# EAGLE design M720db (EAGLE 6.6.0)
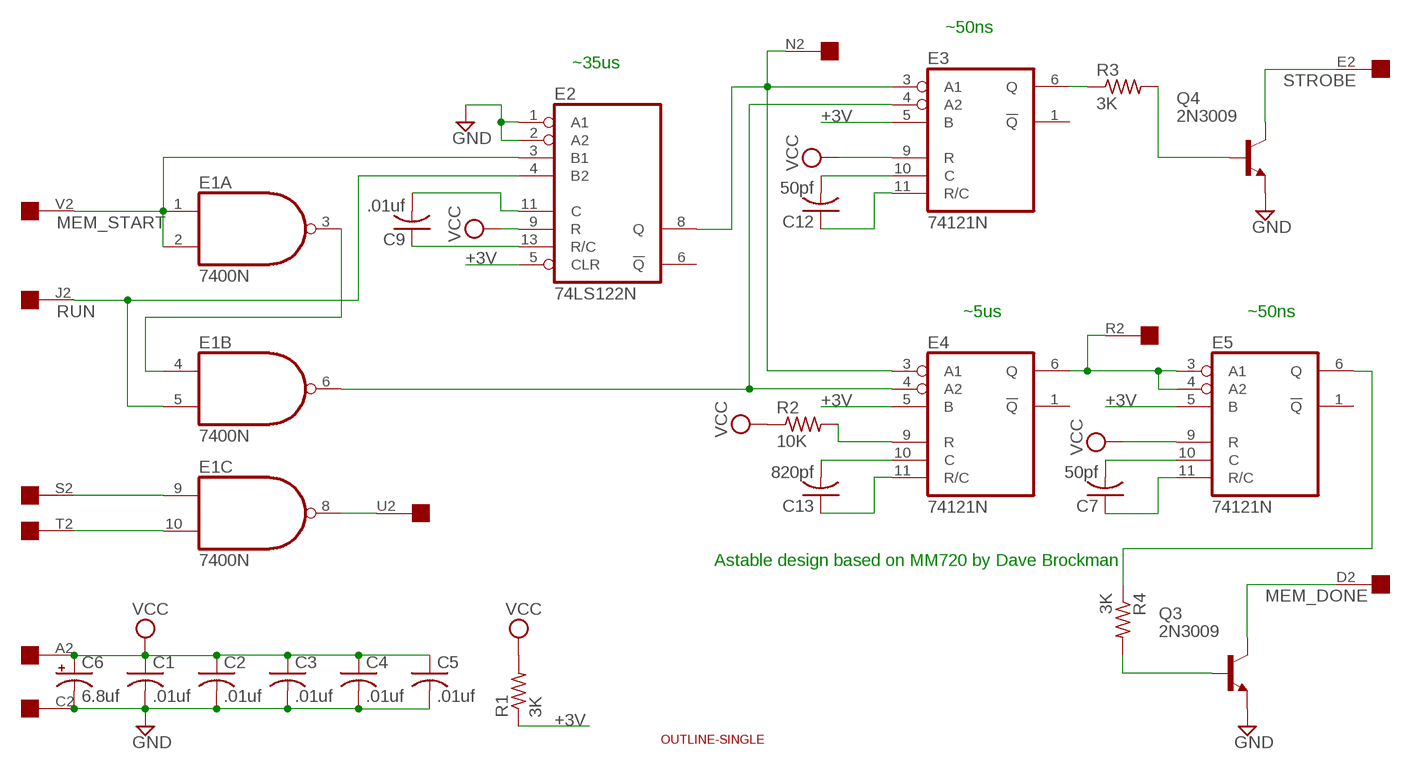
[diagram p0: schematic, sheet 1]

## Parts
C1  .01uf  C-US050-025X075  [C050-025X075]
C2  .01uf  C-US050-025X075  [C050-025X075]
C3  .01uf  C-US050-025X075  [C050-025X075]
C4  .01uf  C-US050-025X075  [C050-025X075]
C5  .01uf  C-US050-025X075  [C050-025X075]
C6  6.8uf  CPOL-USE15-5AXIAL  [E15-5]
C7  50pf  C-US050-025X075  [C050-025X075]
C9  .01uf  C-US050-025X075  [C050-025X075]
C12  50pf  C-US050-025X075  [C050-025X075]
C13  820pf  C-US050-025X075  [C050-025X075]
E1  7400N  [DIL14]
E2  74LS122N  [DIL14]
E3  74121N  [DIL14]
E4  74121N  [DIL14]
E5  74121N  [DIL14]
Q3  2N3009  2N2405  [TO5]
Q4  2N3009  2N2405  [TO5]
R1  3K  R-US_0207/10  [0207/10]
R2  10K  R-US_0207/10  [0207/10]
R3  3K  R-US_0207/10  [0207/10]
R4  3K  R-US_0207/10  [0207/10]
U$1  OUTLINE-SINGLE  [SINGLE]
U$3  EDGE-1  [EDGE-CON1]

## Nets
+3V: E2.5(CLR) E3.5(B) E4.5(B) E5.5(B) R1.1
GND [supply]: C1.2 C2.2 C3.2 C4.2 C5.2 C6.- E2.1(A1) E2.2(A2) Q3.1(E) Q4.1(E) U$3.C2
MEM_DONE: Q3.3(C) U$3.D2
MEM_START: E1.1(A:I0) E1.2(A:I1) E2.3(B1) U$3.V2
N$1: E1.3(A:O) E1.4(B:I0)
N$2: E1.6(B:O) E3.4(A2) E4.4(A2)
N$3: E2.8(Q) E3.3(A1) E4.3(A1) U$3.N2
N$4: C9.2 E2.11(C)
N$5: E1.9(C:I0) U$3.S2
N$6: E1.10(C:I1) U$3.T2
N$7: E1.8(C:O) U$3.U2
N$11: E4.6(Q) E5.3(A1) E5.4(A2) U$3.R2
N$12: C7.2 E5.10(C)
N$13: C7.1 E5.11(R/C)
N$14: E3.6(Q) R3.1
N$15: Q4.2(B) R3.2
N$16: E5.6(Q) R4.1
N$20: C9.1 E2.13(R/C)
N$24: Q3.2(B) R4.2
N$25: C12.1 E3.11(R/C)
N$26: C12.2 E3.10(C)
N$27: C13.1 E4.11(R/C)
N$28: C13.2 E4.10(C)
N$29: E4.9(R) R2.2
RUN: E1.5(B:I1) E2.4(B2) U$3.J2
STROBE: Q4.3(C) U$3.E2
VCC [supply]: C1.1 C2.1 C3.1 C4.1 C5.1 C6.+ E2.9(R) E3.9(R) E5.9(R) R1.2 R2.1 U$3.A2
Unconnected: E1.11(D:O) E1.12(D:I0) E1.13(D:I1) E2.6(!Q) E3.1(!Q) E4.1(!Q) E5.1(!Q) U$3.B2 U$3.F2 U$3.H2 U$3.K2 U$3.L2 U$3.M2 U$3.P2

## Notes on the sheet
- ~50ns
- ~35us
- ~5us | ~50ns
- Astable design based on MM720 by Dave Brockman

## Power pins joined to a net without a drawn wire
GND: E1.7(P:GND) E2.7(GND) E3.7(GND) E4.7(GND) E5.7(GND)
VCC: E1.14(P:VCC) E2.14(VCC) E3.14(VCC) E4.14(VCC) E5.14(VCC)

## Library data of the parts
C1-C5 C7 C9 C12 C13 = rcl:C-US: CAPACITOR, American symbol
C6 = rcl:CPOL-US: POLARIZED CAPACITOR, American symbol
E1 = 74xx-us:74*00: Quad 2-input NAND gate
E2 = 74xx-us:74*122: Retriggerable monostable MULTIVIBRATOR
E3-E5 = 74xx-us:74*121: Monostable MULTIVIBRATOR, schmitt trigger inputs
Q3 Q4 = transistor:2N2405: NPN TRANSISTOR
R1-R4 = rcl:R-US_: RESISTOR, American symbol
U$1 = dec-con:OUTLINE-*: Board outlines for DEC boards.
U$3 = dec-con:EDGE-1: Single-Sided DEC Edge Connector -- (side 2)

## Net classes
1 supply: width 0.813 mm, clearance 0.508 mm

## Board
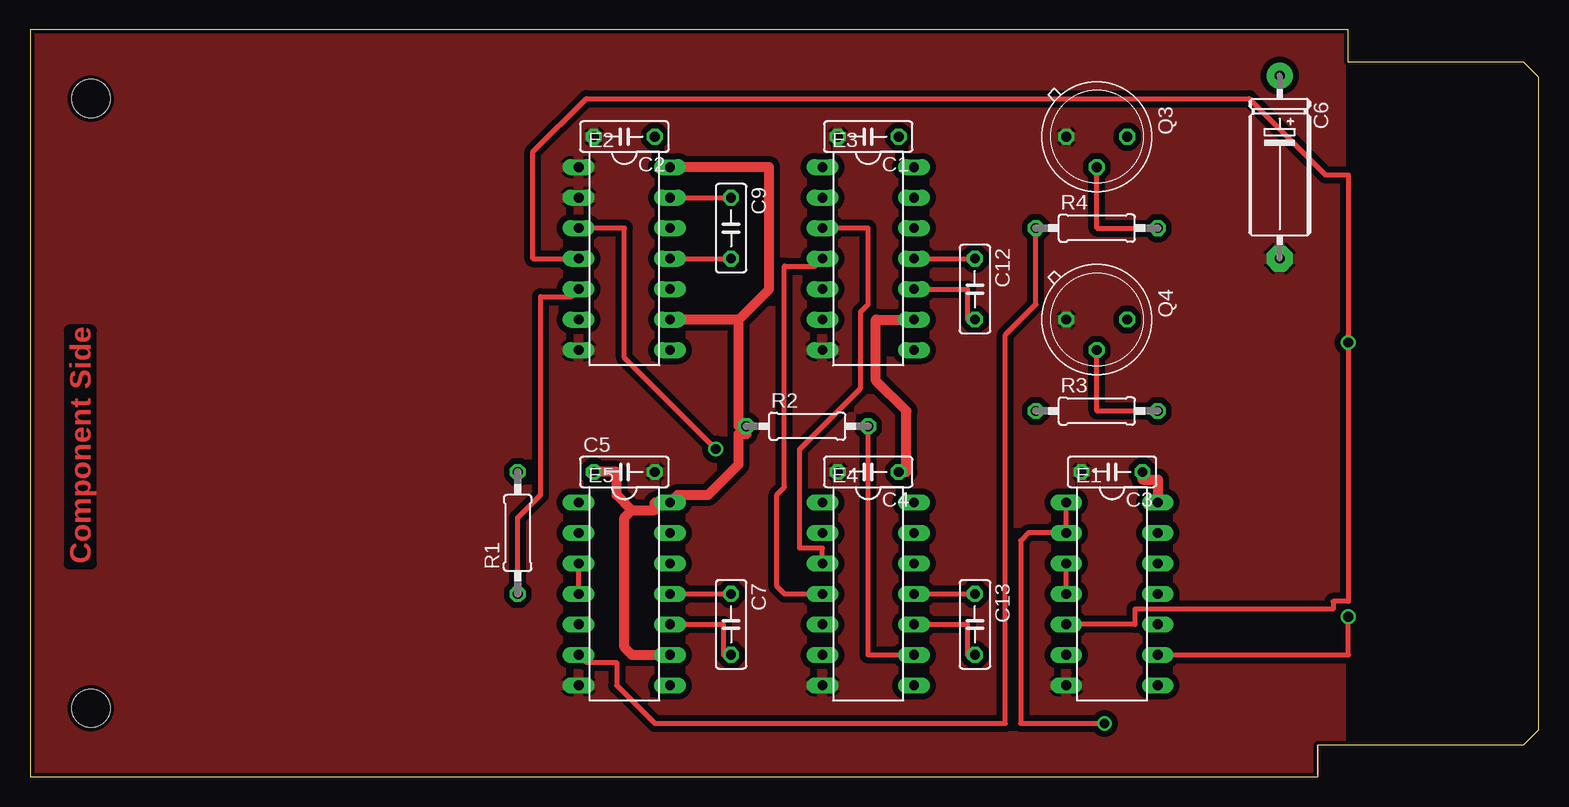
[diagram p1: board, top side]
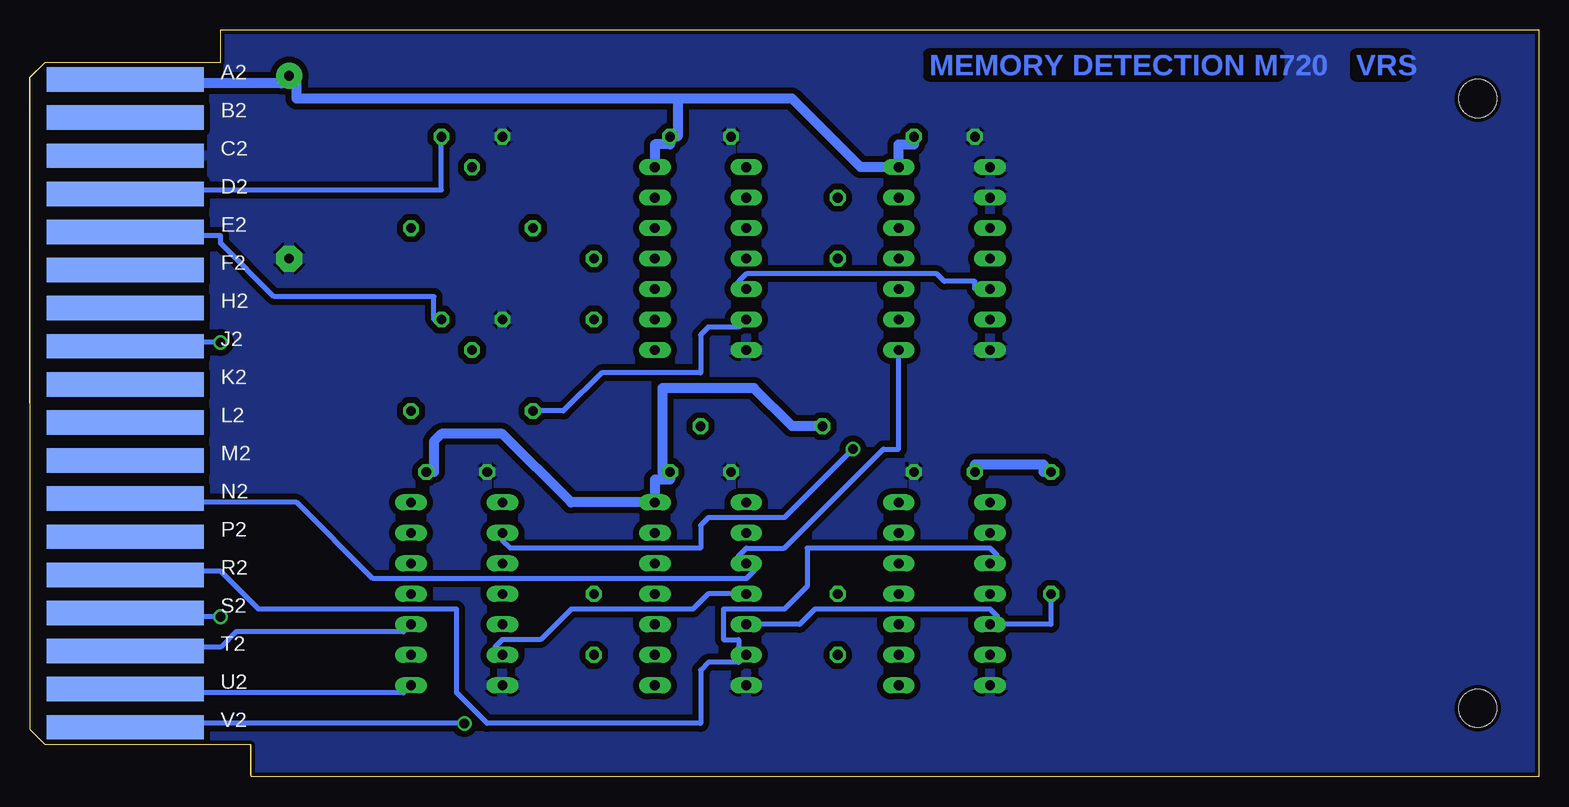
[diagram p2: board, bottom side, seen from below]

Size 125.73 x 62.23 mm. Coordinates in mm from the lower left corner, seen from the top.
Copper layers (1+16): Top 0.035mm / dielectric 1.5mm / Bottom 0.035mm
Design rules "16mils": minimum track width 16mil, minimum drill 32mil, track to track 15mil, track to pad 10mil, pad to pad 10mil, via to via 10mil, smd to smd 10mil, copper to edge 13mil, drill to drill 10mil, minimum pad ring 10mil, minimum via ring 8mil, stop-mask expansion 0mil, vias tented up to drill 0mil, thermal gap 10mil

### Footprints (pad centres in the part's own frame; a part is rotated, then mirrored left to right if it is on the bottom)
C050-025X075 = drill 0.813 octagon: 1 -2.54,0; 2 2.54,0
E15-5 = drill 0.813 pad 2.159: + -7.62,0 | drill 0.813 pad 2.159 octagon: - 7.62,0
DIL14 = drill 0.813 long: 1 -7.62,-3.81; 2 -5.08,-3.81; 3 -2.54,-3.81; 4 0,-3.81; 5 2.54,-3.81; 6 5.08,-3.81; 7 7.62,-3.81; 8 7.62,3.81; 9 5.08,3.81; 10 2.54,3.81; 11 0,3.81; 12 -2.54,3.81; 13 -5.08,3.81; 14 -7.62,3.81
TO5 = drill 0.813 octagon: 1 0,-2.54; 2 2.54,0; 3 0,2.54
0207/10 = drill 0.813 octagon: 1 -5.08,0; 2 5.08,0
SINGLE = hole 3.175: 120.65,56.515; 120.65,5.715
EDGE-CON1 = smd 13.106 x 2.032 bottom: A2 7.938,4.128; B2 7.938,7.303; C2 7.938,10.477; D2 7.938,13.652; E2 7.938,16.828; F2 7.938,20.003; H2 7.938,23.177; J2 7.938,26.352; K2 7.938,29.527; L2 7.938,32.703; M2 7.938,35.877; N2 7.938,39.053; P2 7.938,42.227; R2 7.938,45.403; S2 7.938,48.578; T2 7.938,51.752; U2 7.938,54.928; V2 7.938,58.102

### Placement (x,y rotation side)
C1  69.85,53.34 180 top
C2  49.53,53.34 180 top
C3  90.17,25.4 180 top
C4  69.85,25.4 180 top
C5  49.53,25.4 0 top
C6  104.14,50.8 270 top
C7  58.42,12.7 270 top
C9  58.42,45.72 270 top
C12  78.74,40.64 270 top
C13  78.74,12.7 270 top
E1  90.17,15.24 270 top
E2  49.53,43.18 270 top
E3  69.85,43.18 270 top
E4  69.85,15.24 270 top
E5  49.53,15.24 270 top
Q3  88.9,53.34 270 top
Q4  88.9,38.1 270 top
R1  40.64,20.32 90 top
R2  64.77,29.21 0 top
R3  88.9,30.48 0 top
R4  88.9,45.72 0 top
U$1  125.73,62.23 180 top
U$3  125.73,62.23 180 top

### Tracks (layer width: path | path; a pad name or v marks a point on that pad's centre or on a via)
+3V
  Top 0.406: E2.5 45.09,40.01 42.55,40.01 42.55,23.5 40.64,21.59 R1.1
  Bottom 0.406: E2.5 46.99,40.64 46.99,41.27 49.53,41.27 50.16,41.91 66.04,41.91 66.67,41.27 E3.5 | R1.1 40.64,12.7 E5.5 45.09,13.34 45.72,13.97 60.33,13.97 61.59,12.7 E4.5
GND
  Bottom 0.813: U$3.C2 111.76,51.44 111.76,51.61
  pour Bottom: 0,62.23 111.76,62.23 111.76,0 0,0
  pour Top: 0,62.23 109.22,62.23 109.22,0 0,0
MEM_DONE
  Bottom 0.406: Q3.3 91.44,48.9 111.76,48.9 U$3.D2
MEM_START  (via drill 0.81)
  Top 0.406: E1.1 E1.2 83.19,20.32 82.55,19.68 82.55,4.45 v89.53,4.45 | v57.15,27.3 49.53,34.92 49.53,45.72 E2.3
  Bottom 0.406: v57.15,27.3 62.87,21.59 69.22,21.59 69.85,20.95 69.85,19.05 85.72,19.05 86.36,19.68 E1.2 | v89.53,4.45 111.76,4.45 U$3.V2
N$1
  Top 0.406: E1.4 E1.3
N$2
  Top 0.406: E3.4 65.41,42.55 62.87,42.55 62.87,24.13 62.23,23.5 62.23,15.88 62.87,15.24 E4.4
  Bottom 0.406: E4.4 69.22,15.24 70.48,13.97 80.64,13.97 83.19,11.43 86.36,11.43 87,10.79 E1.6
N$3
  Top 0.406: E3.3 69.85,45.72 69.85,39.37 69.22,38.73 69.22,32.38 64.14,27.3 64.14,19.05 66.04,19.05 E4.3
  Bottom 0.406: E2.8 53.34,27.3 54.61,27.3 62.87,19.05 66.04,19.05 66.67,18.41 E4.3 65.41,17.14 66.04,16.51 97.16,16.51 103.5,22.86 111.76,22.86 U$3.N2
N$4
  Top 0.406: E2.11 C9.2
N$5  (via drill 0.81)
  Top 0.406: v109.86,13.34 109.86,10.16 E1.9
  Bottom 0.406: v109.86,13.34 111.76,13.34 U$3.S2
N$6
  Bottom 0.406: E1.10 94.61,12.06 108.58,12.06 109.86,10.79 111.76,10.79 U$3.T2
N$7
  Bottom 0.406: E1.8 94.61,6.99 111.76,6.99 U$3.U2
N$11
  Top 0.406: E5.4 E5.3
  Bottom 0.406: E5.3 45.09,18.41 45.72,19.05 60.96,19.05 60.96,15.88 62.87,13.97 67.94,13.97 67.94,11.43 66.67,11.43 66.67,10.79 E4.6 66.67,9.53 69.22,9.53 69.85,8.89 69.85,4.45 87.63,4.45 90.17,6.99 90.17,13.97 106.68,13.97 109.86,17.14 111.76,17.14 U$3.R2
N$12
  Top 0.406: E5.10 57.78,12.7 57.78,10.16 C7.2
N$13
  Top 0.406: E5.11 C7.1
N$14
  Bottom 0.406: E3.6 66.67,37.47 69.22,37.47 69.85,36.83 69.85,33.66 78.11,33.66 81.28,30.48 R3.1
N$15
  Top 0.406: R3.2 88.9,30.48 Q4.2
N$16
  Top 0.406: E5.6 46.35,9.53 48.9,9.53 48.9,7.62 52.07,4.45 81.28,4.45 81.28,36.83 83.82,39.37 R4.1
N$20
  Top 0.406: E2.13 C9.1
N$24
  Top 0.406: R4.2 88.9,45.72 Q3.2
N$25
  Top 0.406: E3.11 C12.1
N$26
  Top 0.406: E3.10 78.11,40.64 78.11,38.1 C12.2
N$27
  Top 0.406: E4.11 C13.1
N$28
  Top 0.406: E4.10 78.11,12.7 78.11,10.16 C13.2
N$29
  Top 0.406: E4.9 69.85,10.16 R2.2
RUN  (via drill 0.81)
  Top 0.406: E1.5 92.08,12.7 92.08,13.97 108.58,13.97 108.58,14.61 109.86,14.61 v109.86,36.2 109.86,50.16 107.95,50.16 101.6,56.52 46.35,56.52 41.91,52.07 41.91,43.18 E2.4
  Bottom 0.406: v109.86,36.2 111.76,36.2 U$3.J2
STROBE
  Bottom 0.406: Q4.3 92.08,38.1 92.08,40.01 105.41,40.01 109.86,44.45 109.86,45.09 111.76,45.09 U$3.E2
VCC
  Top 0.813: C3.1 92.71,24.77 93.98,24.77 E1.14 | E3.9 70.48,38.1 70.48,33.02 73.03,30.48 73.03,25.4 C4.1 | 50.16,22.23 49.53,21.59 49.53,10.79 50.16,10.16 E5.9 | 50.16,22.23 52.07,22.23 52.07,22.86 E5.14 53.98,23.5 56.52,23.5 59.05,26.04 59.05,28.57 59.69,28.57 R2.1 59.05,29.21 59.05,38.1 | 59.05,38.1 E2.9 | 59.05,38.1 61.59,40.64 61.59,50.8 E2.14 | 50.16,22.23 48.9,23.5 48.9,25.4 C5.1
  Bottom 0.813: U$3.A2 111.76,57.78 104.78,57.78 C6.+ 103.5,57.78 103.5,56.52 71.75,56.52 | C3.1 92.08,25.4 92.08,27.94 91.44,28.57 86.36,28.57 80.64,22.86 E4.14 73.66,24.77 72.39,24.77 C4.1 73.03,25.4 73.03,32.38 65.41,32.38 62.23,29.21 R2.1 | R1.2 41.27,25.4 41.27,26.04 46.99,26.04 C5.1 | E3.14 73.66,52.7 72.39,52.7 C1.1 71.75,53.34 71.75,56.52 | C2.1 52.07,52.7 53.34,52.7 E2.14 56.52,50.8 62.23,56.52 71.75,56.52

### Text on the board
Top: Component Side
Bottom: VRS | MEMORY DETECTION M720